# Altium schematic sheet Analyzer_MCUSchematic.SchDoc
size A3; SheetNumber: 2; SheetTotal: 3
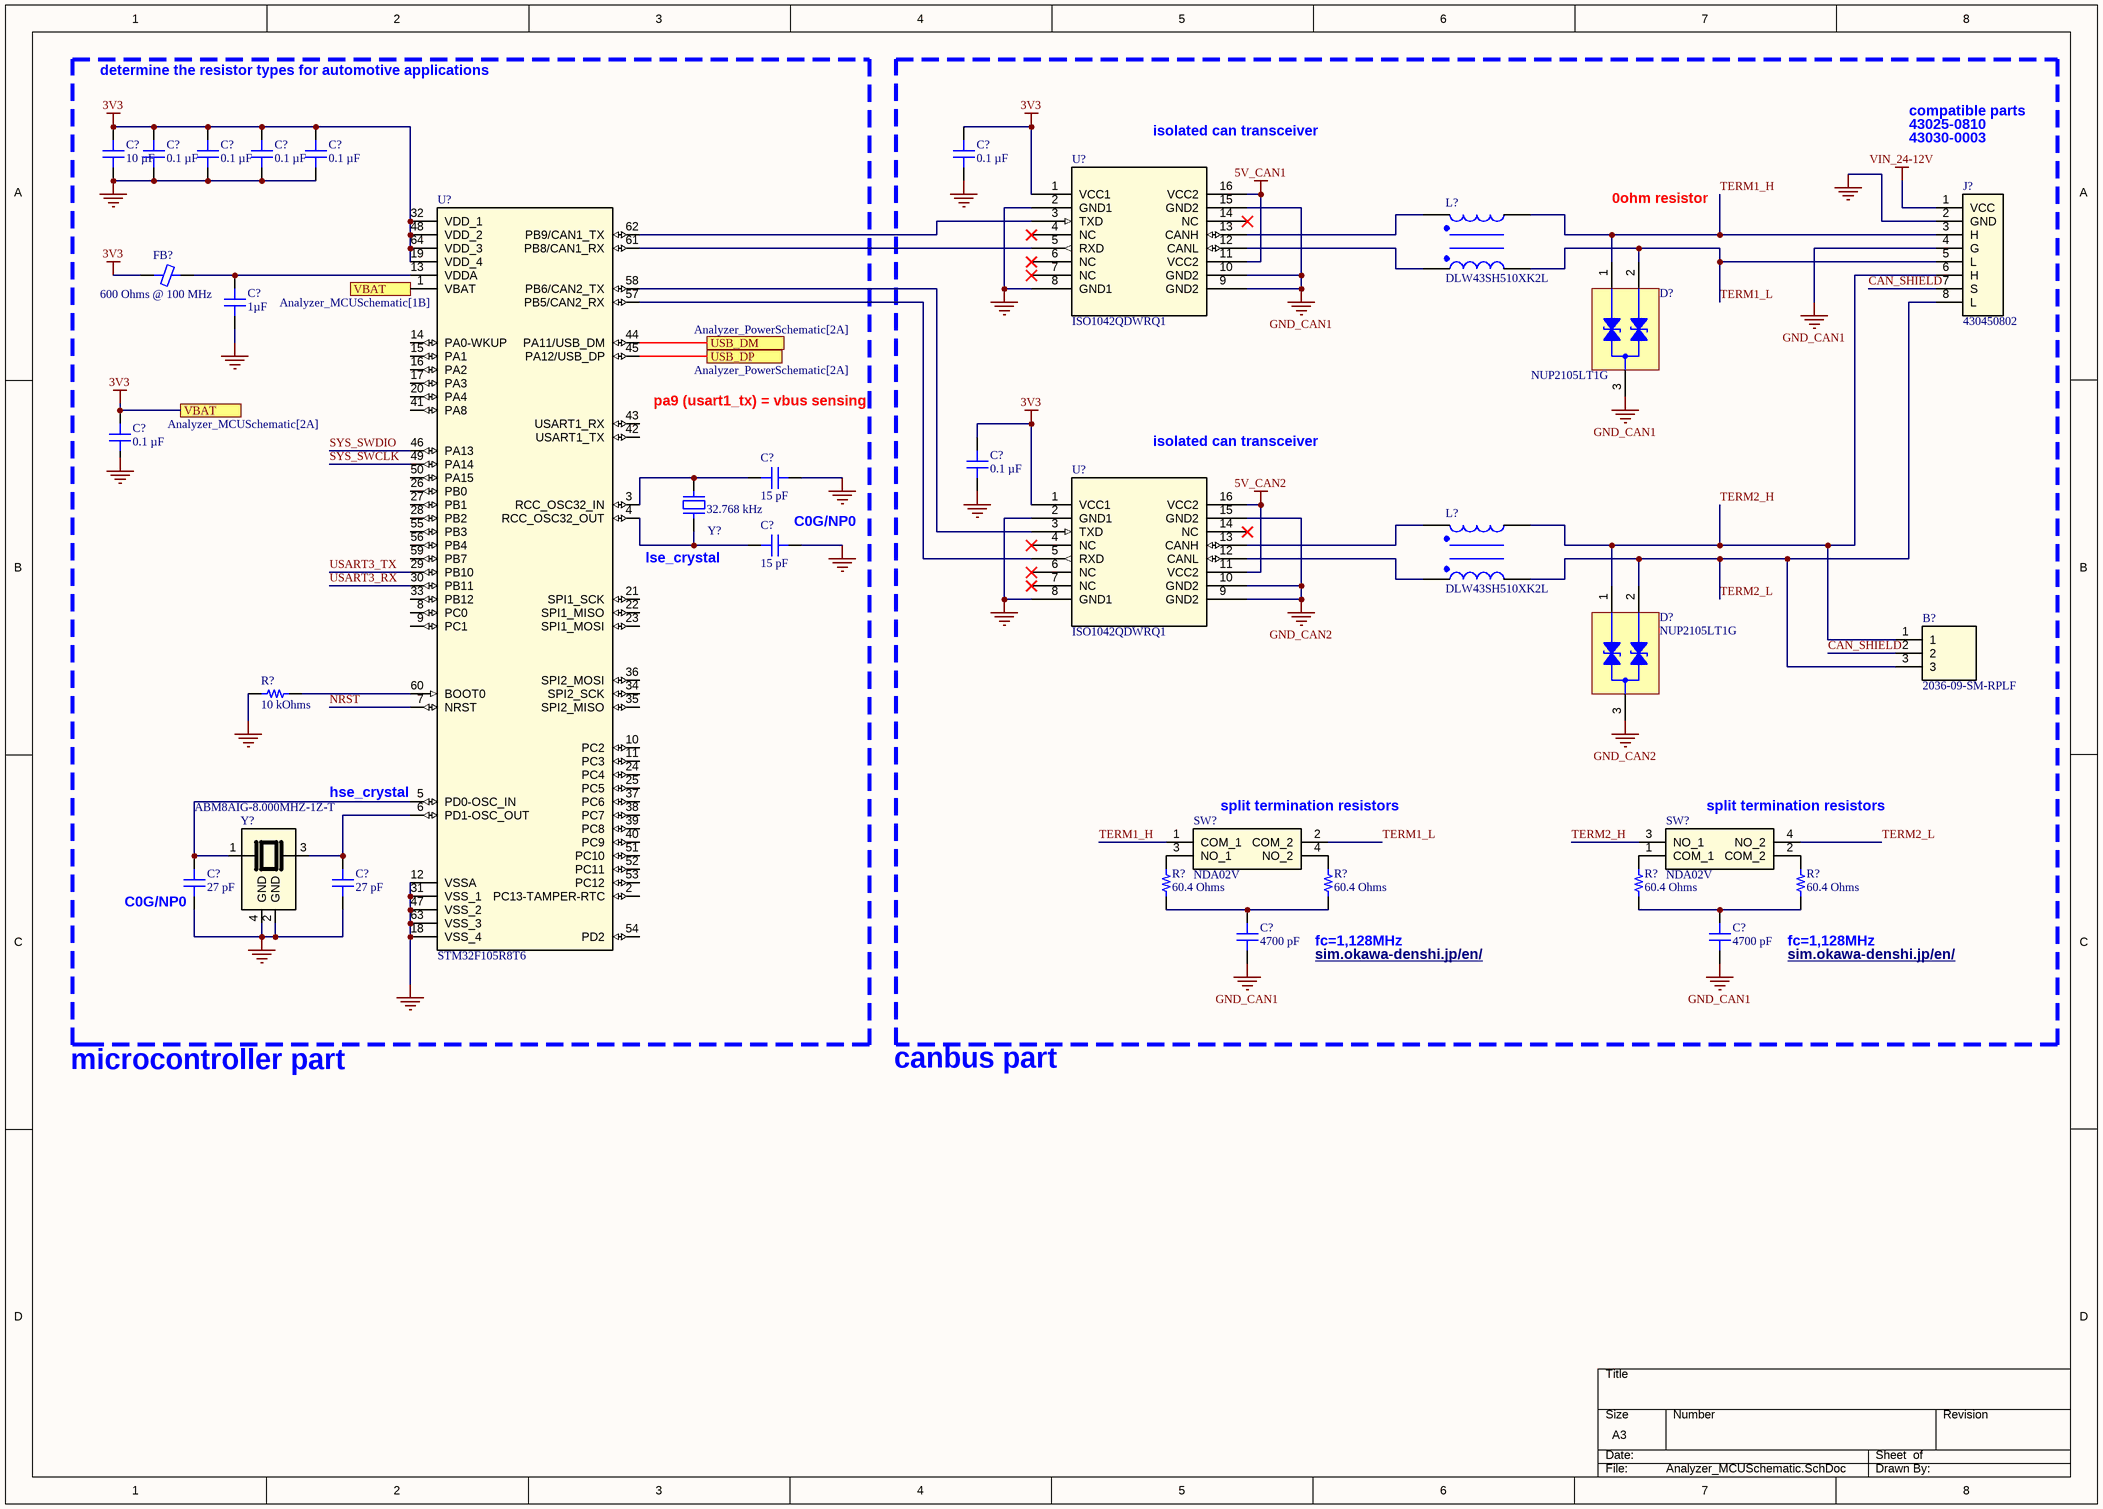
[diagram p0: Analyzer_MCUSchematic.SchDoc]

## Parts
(Parts that share a designator on the sheet are numbered #1, #2 ... from top to bottom, then left to right.)
B?  2036-09-SM-RPLF  [203609SMRPLF]
C?#1  10 µF  [CAP 0805_2012]
C?#2  0.1 µF  [CAP 0603_1608]
C?#3  0.1 µF  [CAP 0603_1608]
C?#4  0.1 µF  [CAP 0603_1608]
C?#5  0.1 µF  [CAP 0603_1608]
C?#6  0.1 µF  [CAP 0603_1608]
C?#7  1µF  [CAP 0603_1608]
C?#8  0.1 µF  [CAP 0603_1608]
C?#9  0.1 µF  [CAP 0603_1608]
C?#10  15 pF  [CAP 0603_1608]
C?#11  15 pF  [CAP 0603_1608]
C?#12  27 pF  [CAP 0603_1608]
C?#13  27 pF  [CAP 0603_1608]
C?#14  4700 pF  [CAP 0603_1608]
C?#15  4700 pF  [CAP 0603_1608]
D?#1  NUP2105LT1G  [ON SEMI SOT-23-3]
D?#2  NUP2105LT1G  [ON SEMI SOT-23-3]
FB?  600 Ohms @ 100 MHz  [FER 0603_1608]
J?  430450802  [CONN_SD-43045-001_08_MOL]
L?#1  DLW43SH510XK2L  [FIL_DLW43SH510XK2L]
L?#2  DLW43SH510XK2L  [FIL_DLW43SH510XK2L]
R?#1  10 kOhms  [RES 0603_1608]
R?#2  60.4 Ohms  [RES 0603_1608]
R?#3  60.4 Ohms  [RES 0603_1608]
R?#4  60.4 Ohms  [RES 0603_1608]
R?#5  60.4 Ohms  [RES 0603_1608]
SW?#1  NDA02V  [NDA02V]
SW?#2  NDA02V  [NDA02V]
U?#1  ISO1042QDWRQ1  [DW16_TEX]
U?#2  STM32F105R8T6  [QFP50P1200X1200X160-64N]
U?#3  ISO1042QDWRQ1  [DW16_TEX]
Y?#1  32.768 kHz  [ABRACON ABS06]
Y?#2  ABM8AIG-8.000MHZ-1Z-T  [XTAL_ABM8AIG-8.000MHZ-1Z-T]

## Ports
USB_DM (see Analyzer_PowerSchematic[2A]), USB_DP (see Analyzer_PowerSchematic[2A]), VBAT (see Analyzer_MCUSchematic[1B]), VBAT (see Analyzer_MCUSchematic[2A])

## Nets
3V3: C?#1.2 C?#2.2 C?#3.2 C?#4.2 C?#5.2 C?#6.2 C?#8.2 C?#9.2 FB?.1 U?#1.1(VCC1) U?#2.1(VBAT) U?#2.19(VDD_4) U?#2.32(VDD_1) U?#2.48(VDD_2) U?#2.64(VDD_3) U?#3.1(VCC1) ; port VBAT
5V_CAN1: U?#1.11(VCC2) U?#1.16(VCC2)
5V_CAN2: U?#3.11(VCC2) U?#3.16(VCC2)
GND: C?#1.1 C?#2.1 C?#3.1 C?#4.1 C?#5.1 C?#6.1 C?#7.1 C?#9.1 C?#10.2 C?#11.2 C?#12.1 C?#13.1 J?.2(GND) R?#1.1 U?#1.2(GND1) U?#1.8(GND1) U?#2.12(VSSA) U?#2.18(VSS_4) U?#2.31(VSS_1) U?#2.47(VSS_2) U?#2.63(VSS_3) U?#3.2(GND1) U?#3.8(GND1) Y?#2.2(GND) Y?#2.4(GND)
GND_CAN1: C?#14.1 C?#15.1 D?#1.3(I/O_2) J?.4(G) U?#1.9(GND2) U?#1.10(GND2) U?#1.15(GND2)
GND_CAN2: D?#2.3(I/O_2) U?#3.9(GND2) U?#3.10(GND2) U?#3.15(GND2)
VIN_24-12V: J?.1(VCC)
CAN_SHIELD: B?.2 J?.7(S)
NRST: U?#2.7(NRST)
SYS_SWCLK: U?#2.49(PA14)
SYS_SWDIO: U?#2.46(PA13)
TERM1_H: D?#1.1(I/O_1) J?.3(H) L?#1.2 SW?#2.1(COM_1)
TERM1_L: D?#1.2(GND) J?.5(L) L?#1.3 SW?#2.2(COM_2)
TERM2_H: B?.1 D?#2.1(I/O_1) J?.6(H) L?#2.2 SW?#1.3(NO_1)
TERM2_L: B?.3 D?#2.2(GND) J?.8(L) L?#2.3 SW?#1.4(NO_2)
USART3_RX: U?#2.30(PB11)
USART3_TX: U?#2.29(PB10)
USB_DM: U?#2.44(PA11/USB_DM) ; port USB_DM
USB_DP: U?#2.45(PA12/USB_DP) ; port USB_DP
NetC?#7_2: C?#7.2 FB?.2 U?#2.13(VDDA)
NetC?#10_1: C?#10.1 U?#2.3(RCC_OSC32_IN) Y?#1.1
NetC?#11_1: C?#11.1 U?#2.4(RCC_OSC32_OUT) Y?#1.2
NetC?#12_2: C?#12.2 Y?#2.1
NetC?#13_2: C?#13.2 Y?#2.3
NetC?#14_2: C?#14.2 R?#2.2 R?#3.2
NetC?#15_2: C?#15.2 R?#4.2 R?#5.2
NetL?#1_1: L?#1.1 U?#1.13(CANH)
NetL?#1_4: L?#1.4 U?#1.12(CANL)
NetL?#2_1: L?#2.1 U?#3.13(CANH)
NetL?#2_4: L?#2.4 U?#3.12(CANL)
NetR?#1_2: R?#1.2 U?#2.60(BOOT0)
NetR?#2_1: R?#2.1 SW?#2.3(NO_1)
NetR?#3_1: R?#3.1 SW?#2.4(NO_2)
NetR?#4_1: R?#4.1 SW?#1.1(COM_1)
NetR?#5_1: R?#5.1 SW?#1.2(COM_2)
NetU?#1_3: U?#1.3(TXD) U?#2.62(PB9/CAN1_TX)
NetU?#1_5: U?#1.5(RXD) U?#2.61(PB8/CAN1_RX)
NetU?#2_57: U?#2.57(PB5/CAN2_RX) U?#3.5(RXD)
NetU?#2_58: U?#2.58(PB6/CAN2_TX) U?#3.3(TXD)

Not connected (* = marked no-connect by the designer): C?#8 1; U?#1 4(NC)* 6(NC)* 7(NC)* 14(NC)*; U?#2 2(PC13-TAMPER-RTC) 5(PD0-OSC_IN) 6(PD1-OSC_OUT) 8(PC0) 9(PC1) 10(PC2) 11(PC3) 14(PA0-WKUP) 15(PA1) 16(PA2) 17(PA3) 20(PA4) 21(SPI1_SCK) 22(SPI1_MISO) 23(SPI1_MOSI) 24(PC4) 25(PC5) 26(PB0) 27(PB1) 28(PB2) 33(PB12) 34(SPI2_SCK) 35(SPI2_MISO) 36(SPI2_MOSI) 37(PC6) 38(PC7) 39(PC8) 40(PC9) 41(PA8) 42(USART1_TX) 43(USART1_RX) 50(PA15) 51(PC10) 52(PC11) 53(PC12) 54(PD2) 55(PB3) 56(PB4) 59(PB7); U?#3 4(NC)* 6(NC)* 7(NC)* 14(NC)*

## Notes on the sheet
- determine the resistor types for automotive applications
- isolated can transceiver
- compatible parts
- 43025-0810
- 43030-0003
- 0ohm resistor
- (near U?#2) pa9 (usart1_tx) = vbus sensing
- lse_crystal
- (near C?#11) C0G/NP0
- (near U?#2) hse_crystal
- (near SW?#2) split termination resistors
- (near SW?#1) split termination resistors
- (near C?#12) C0G/NP0
- (near R?#3) fc=1,128MHz
- sim.okawa-denshi.jp/en/ <http://sim.okawa-denshi.jp/en/>
- (near R?#5) fc=1,128MHz
- microcontroller part
- canbus part
- Labels drawn without touching a wire or pin: GND

## Library data of the parts
B? = 2036-09-SM-RPLF: SURGE ARRESTOR GDT 90V SMT Bourns 2036 Series 90V 10 kA@ 10 Operation, 20 kA@ 1 Operation SMD 3 Electrode Gas Discharge Tube; Geometry.Height: 5.2mm; Manufacturer_Name: Bourns; Manufacturer_Part_Number: 2036-09-SM-RPLF; Mouser Part Number: 652-2036-09-SM-RPLF; Mouser Price/Stock: https://www.mouser.co.uk/ProductDetail/Bourns/2036-09-SM-RPLF?qs=lCOfWMjvbt%252BBO3tBZtiSUQ%3D%3D; Arrow Part Number: 2036-09-SM-RPLF; Arrow Price/Stock: https://www.arrow.com/en/products/2036-09-sm-rplf/bourns?utm_currency=USD&region=nac; Datasheet Link: https://www.bourns.com/PDFs/2036-xx-SM.pdf
C?#1 = C2012X7R1A106K125AE: CAP CER 10UF 10V X7R 0805; manufacturer: TDK Corporation; Tolerance: ±10%; Part Number: C2012X7R1A106K125AE; Capacitance: 10 µF; Applications: Boardflex Sensitive; componentlink1description: Datasheet; componentlink1url: https://product.tdk.com/info/en/catalog/datasheets/mlcc_commercial_soft_en.pdf?ref_disty=digikey; componentlink2description: DigiKey Link; componentlink2url: https://www.digikey.com/en/products/detail/tdk-corporation/C2012X7R1A106K125AE/5809181; Device Package: 0805 (2012 Metric); Features: Soft Termination; lastupdated: 6.04.2026 19:33:17; Lifecycle Status: Active; Minimum Order: 1; Mounting Type: Surface Mount, MLCC; Operating Temperature: -55°C ~ 125°C; Package / Case: 0805 (2012 Metric); packaging: TapeAndReel; partid: 3036; Part Status: Active; price: 0.08; series: C; Size / Dimension: 0.079" L x 0.049" W (2.00mm x 1.25mm); Supplier 1: DigiKey; Supplier Part Number 1: 445-173616-1-ND; Temperature Coefficient: X7R; Thickness (Max): 0.059" (1.50mm); value: 10 µF; Voltage - Rated: 10V
C?#2-C?#6 C?#8 C?#9 = 0603B104J160CT: CAP CER 0.1UF 16V X7R 0603; manufacturer: Walsin Technology Corporation; Tolerance: ±5%; Part Number: 0603B104J160CT; Capacitance: 0.1 µF; Applications: General Purpose; componentlink1description: Datasheet; componentlink1url: http://www.passivecomponent.com/wp-content/uploads/2018/10/MLCC.pdf; componentlink2description: DigiKey Link; componentlink2url: https://www.digikey.com/en/products/detail/walsin-technology-corporation/0603B104J160CT/9354886; Device Package: 0603 (1608 Metric); lastupdated: 6.04.2026 19:23:13; Lifecycle Status: Active; Minimum Order: 1; Mounting Type: Surface Mount, MLCC; Operating Temperature: -55°C ~ 125°C; Package / Case: 0603 (1608 Metric); packaging: TapeAndReel; partid: 13150; Part Status: Active; price: 0.01; series: -; Size / Dimension: 0.063" L x 0.031" W (1.60mm x 0.80mm); Supplier 1: DigiKey; Supplier Part Number 1: 1292-1389-1-ND; Temperature Coefficient: X7R; Thickness (Max): 0.034" (0.87mm); value: 0.1 µF; Voltage - Rated: 16V
C?#7 = 0603YC105KAT2A: CAP CER 1UF 16V X7R 0603; manufacturer: AVX Corporation; Tolerance: ±10%; Part Number: 0603YC105KAT2A; Capacitance: 1µF; Applications: General Purpose; componentlink1description: Datasheet; componentlink1url: http://datasheets.avx.com/X7RDielectric.pdf; componentlink2description: DigiKey Link; componentlink2url: http://digikey.com/product-detail/en/avx-corporation/0603YC105KAT2A/478-5010-1-ND/1888221; Device Package: 0603 (1608 Metric); lastupdated: 2.09.2020 01:03:14; Lifecycle Status: Active; Minimum Order: 1; Mounting Type: Surface Mount, MLCC; Operating Temperature: -55°C ~ 125°C; Package / Case: 0603 (1608 Metric); packaging: TapeAndReel; partid: 14128; Part Status: Active; price: 0.04; series: -; Size / Dimension: 0.063" L x 0.032" W (1.60mm x 0.81mm); Supplier 1: DigiKey; Supplier Part Number 1: 478-5010-1-ND; Temperature Coefficient: X7R; Thickness (Max): 0.035" (0.90mm); value: 1µF; Voltage - Rated: 16V
C?#10 C?#11 = C0603C150J5GACAUTO: CAP CER 15PF 50V C0G/NP0 0603; manufacturer: KEMET; Temperature Coefficient: C0G, NP0; Tolerance: ±5%; Part Number: C0603C150J5GACAUTO; Capacitance: 15 pF; Applications: Automotive; componentlink1description: Datasheet; componentlink1url: https://api.kemet.com/component-edge/download/datasheet/C0603C150J5GACAUTO.pdf; componentlink2description: DigiKey Link; componentlink2url: https://www.digikey.com/en/products/detail/kemet/C0603C150J5GACAUTO/3314856; Device Package: 0603 (1608 Metric); Features: Low ESL; lastupdated: 6.04.2026 19:23:31; Lifecycle Status: Active; Minimum Order: 1; Mounting Type: Surface Mount, MLCC; Operating Temperature: -55°C ~ 125°C; Package / Case: 0603 (1608 Metric); packaging: TapeAndReel; partid: 7972; Part Status: Active; price: 0.01; Ratings: AEC-Q200; series: SMD Auto C0G; Size / Dimension: 0.063" L x 0.031" W (1.60mm x 0.80mm); Supplier 1: DigiKey; Supplier Part Number 1: 399-6859-1-ND; Thickness (Max): 0.034" (0.87mm); value: 15 pF; Voltage - Rated: 50V
C?#12 C?#13 = C0603C270J5GACAUTO: CAP CER 27PF 50V C0G/NP0 0603; manufacturer: KEMET; Temperature Coefficient: C0G, NP0; Tolerance: ±5%; Part Number: C0603C270J5GACAUTO; Capacitance: 27 pF; Applications: Automotive; componentlink1description: Datasheet; componentlink1url: https://api.kemet.com/component-edge/download/datasheet/C0603C270J5GACAUTO.pdf; componentlink2description: DigiKey Link; componentlink2url: https://www.digikey.com/en/products/detail/kemet/C0603C270J5GACAUTO/7516234; Device Package: 0603 (1608 Metric); Features: Low ESL; lastupdated: 6.04.2026 19:23:16; Lifecycle Status: Active; Minimum Order: 1; Mounting Type: Surface Mount, MLCC; Operating Temperature: -55°C ~ 125°C; Package / Case: 0603 (1608 Metric); packaging: TapeAndReel; partid: 12459; Part Status: Active; price: 0.01; Ratings: AEC-Q200; series: SMD Auto C0G; Size / Dimension: 0.063" L x 0.031" W (1.60mm x 0.80mm); Supplier 1: DigiKey; Supplier Part Number 1: 399-16001-1-ND; Thickness (Max): 0.034" (0.87mm); value: 27 pF; Voltage - Rated: 50V
C?#14 C?#15 = C1608NP01H472J080AA: CAP CER 4700PF 50V NP0 0603; manufacturer: TDK Corporation; Temperature Coefficient: C0G, NP0; Tolerance: ±5%; Part Number: C1608NP01H472J080AA; Capacitance: 4700 pF; Applications: General Purpose; componentlink1description: Datasheet; componentlink1url: https://product.tdk.com/info/en/catalog/datasheets/mlcc_commercial_hightemp_en.pdf?ref_disty=digikey; componentlink2description: DigiKey Link; componentlink2url: https://www.digikey.com/en/products/detail/tdk-corporation/C1608NP01H472J080AA/3951319; Device Package: 0603 (1608 Metric); Features: High Temperature; lastupdated: 6.04.2026 19:23:27; Lifecycle Status: Active; Minimum Order: 1; Mounting Type: Surface Mount, MLCC; Operating Temperature: -55°C ~ 150°C; Package / Case: 0603 (1608 Metric); packaging: TapeAndReel; partid: 9062; Part Status: Active; price: 0.04; series: C; Size / Dimension: 0.063" L x 0.031" W (1.60mm x 0.80mm); Supplier 1: DigiKey; Supplier Part Number 1: 445-14083-1-ND; Thickness (Max): 0.035" (0.90mm); value: 4700 pF; Voltage - Rated: 50V
D?#1 D?#2 = NUP2105LT1G: TVS DIODE 24V 44V SOT23-3; Manufacturer: ON Semiconductor; Bidirectional Channels: 2; Capacitance @ Frequency: 30pF @ 1MHz; Current - Peak Pulse (10/1000µs): 8A (8/20µs); Power Line Protection: No; Power - Peak Pulse: 350W; Type: Zener; Voltage - Breakdown (Min): 26.2V; Voltage - Reverse Standoff (Typ): 24V (Min); Part Number: NUP2105LT1G; Applications: General Purpose; ComponentLink1Description: Datasheet; ComponentLink1URL: http://www.onsemi.com/pub/Collateral/NUP2105L-D.PDF; ComponentLink2Description: DigiKey Link; ComponentLink2URL: http://digikey.com/product-detail/en/on-semiconductor/NUP2105LT1G/NUP2105LT1GOSCT-ND/1485001; Device Package: TO-236-3, SC-59, SOT-23-3; LastUpdated: 30.03.2020 16:33:57; Lifecycle Status: Active; Minimum Order: 1; Mounting Type: Surface Mount; Operating Temperature: -55°C ~ 150°C (TJ); Package / Case: TO-236-3, SC-59, SOT-23-3; Packaging: TapeAndReel; PartId: 10506; Part Status: Active; Price: 0.09; Series: -; Supplier 1: DigiKey; Supplier Part Number 1: NUP2105LT1GOSCT-ND; Supplier Device Package: SOT-23-3 (TO-236); Voltage - Clamping (Max) @ Ipp: 44V
FB? = GZ1608D601TF: FERRITE BEAD 600 OHM 0603 1LN; Manufacturer: Shenzhen Sunlord Electronics Co., Ltd.; Current Rating (Max): 200mA; DC Resistance (DCR) (Max): 450mOhm; Filter Type: Signal Line; Number of Lines: 1; Part Number: GZ1608D601TF; ComponentLink1Description: Datasheet; ComponentLink1URL: https://www.sunlordinc.com/Download.aspx?file=L1VwbG9hZEZpbGVzL1BERl9DYXQvMjAxOTA0MDgxMzU0MTk3NjMucGRm&lan=en; ComponentLink2Description: DigiKey Link; ComponentLink2URL: https://www.digikey.com/en/products/detail/shenzhen-sunlord-electronics-co-ltd/GZ1608D601TF/14120345; Device Package: 0603 (1608 Metric); Height (Max): 0.037" (0.95mm); Impedance @ Frequency: 600 Ohms @ 100 MHz; LastUpdated: 5.04.2026 20:28:01; Lifecycle Status: Active; Minimum Order: 1; Mounting Type: Surface Mount; Operating Temperature: -55°C ~ 125°C; Package / Case: 0603 (1608 Metric); Packaging: TapeAndReel; PartId: 2637; Part Status: Active; Price: 0.01; Series: GZ; Size / Dimension: 0.063" L x 0.031" W (1.60mm x 0.80mm); Supplier 1: DigiKey; Supplier Part Number 1: 3442-GZ1608D601TFCT-ND; Value: 600 Ohms @ 100 MHz
J? = 430450802: Micro-Fit 3.0 Right-Angle Header, 3.00mm Pitch, Dual Row, 8 Circuits, with Snap-in Plastic Peg PCB Lock, 0.76Âµm Gold Plating, Glow-Wire Capable, Black; Manufacturer_Name: Molex; Copyright: Copyright (C) 2026 Ultra Librarian. All rights reserved.; Manufacturer_Part_Number: 430450802; Datasheet: https://www.molex.com/en-us/products/part-detail-pdf/430450802?display=pdf; Digi-Key_Part_Number_1: WM1822-ND; RefDes: RefDes; Type: Type
L?#1 L?#2 = DLW43SH510XK2L: 51µH @ 1MHz 2 Line Common Mode Choke Surface Mount 230mA DCR 1Ohm; MF: Murata; Value: *; MP: DLW43SH510XK2L; SnapEDA_Link: https://www.snapeda.com/parts/DLW43SH510XK2L/Murata/view-part/4300308/?ref=snap; Availability: Unavailable; Price: None; Package: 1812 Murata
R?#1 = RT0603FRE0710KL: RES SMD 10K OHM 1% 1/10W 0603; Manufacturer: Yageo; Power (Watts): 0.1W, 1/10W; Temperature Coefficient: ±50ppm/°C; Part Number: RT0603FRE0710KL; Value: 10 kOhms; ComponentLink1Description: Datasheet; ComponentLink1URL: https://www.yageo.com/upload/media/product/productsearch/datasheet/rchip/PYu-RT_1-to-0.01_RoHS_L_11.pdf; ComponentLink2Description: DigiKey Link; ComponentLink2URL: https://www.digikey.com/en/products/detail/yageo/RT0603FRE0710KL/1075040; Composition: Thin Film; Device Package: 0603 (1608 Metric); Height - Seated (Max): 0.022" (0.55mm); LastUpdated: 6.04.2026 19:44:01; Lifecycle Status: Active; Minimum Order: 1; Number of Terminations: 2; Operating Temperature: -55°C ~ 155°C; Package / Case: 0603 (1608 Metric); Packaging: TapeAndReel; PartId: 5671; Part Status: Active; Price: 0.01; Resistance: 10 kOhms; Series: RT; Size / Dimension: 0.063" L x 0.031" W (1.60mm x 0.80mm); Supplier 1: DigiKey; Supplier Part Number 1: YAG2321CT-ND; Supplier Device Package: 0603; Tolerance: ±1%
R?#2-R?#5 = RC0603FR-0760R4L: RES 60.4 OHM 1% 1/10W 0603; Manufacturer: Yageo; Power (Watts): 0.1W, 1/10W; Temperature Coefficient: ±100ppm/°C; Part Number: RC0603FR-0760R4L; Value: 60.4 Ohms; ComponentLink1Description: Datasheet; ComponentLink1URL: https://www.yageo.com/upload/media/product/productsearch/datasheet/rchip/PYu-RC_Group_51_RoHS_L_10.pdf; ComponentLink2Description: DigiKey Link; ComponentLink2URL: https://www.digikey.com/en/products/detail/yageo/RC0603FR-0760R4L/727327; Composition: Thick Film; Device Package: 0603 (1608 Metric); Features: Moisture Resistant; Height - Seated (Max): 0.022" (0.55mm); LastUpdated: 6.04.2026 19:43:46; Lifecycle Status: Active; Minimum Order: 1; Number of Terminations: 2; Operating Temperature: -55°C ~ 155°C; Package / Case: 0603 (1608 Metric); Packaging: CutTape; PartId: 19096; Part Status: Active; Price: 0.01; Resistance: 60.4 Ohms; Series: RC_L; Size / Dimension: 0.063" L x 0.031" W (1.60mm x 0.80mm); Supplier 1: DigiKey; Supplier Part Number 1: 311-60.4HRCT-ND; Supplier Device Package: 0603; Tolerance: ±1%
SW?#1 SW?#2 = NDA02V: SWITCH DIL RA SPST 50MA 24V TH; Manufacturer_Name: Apem; Geometry.Height: 9.9mm; Manufacturer_Part_Number: NDA02V; Mouser Part Number: 642-NDA02V; Mouser Price/Stock: https://www.mouser.co.uk/ProductDetail/Apem/NDA02V?qs=W0yvOO0ixfEICVFeWba0EQ%3D%3D; Arrow Part Number: *; Arrow Price/Stock: *; Datasheet Link: https://www.apem.com/us/nda-series-174.html
U?#1 U?#3 = ISO1042QDWRQ1: Automotive, isolated CAN transceiver with 70-V bus fault protection & flexible data rate 16-SOIC -40 to 125; Manufacturer_Name: Texas Instruments; Copyright: Copyright (C) 2026 Ultra Librarian. All rights reserved.; Manufacturer_Part_Number: ISO1042QDWRQ1; Datasheet: https://www.ti.com/lit/gpn/iso1042-q1; Digi-Key_Part_Number_1: 296-52278-1-ND; Digi-Key_Part_Number_2: 296-52278-2-ND; Digi-Key_Part_Number_3: 296-52278-6-ND; RefDes: RefDes; Type: Type
U?#2 = STM32F105R8T6: Mainstream Connectivity line, ARM Cortex-M3 with 64 Kbytes Flash, 72 MHz CPU, CAN, USB 2.0 OTG; MF: {'manufacturer': u'STMicroelectronics'}; Package: None; Price: None; Value: *; MP: STM32F105R8T6; Availability: Unavailable
Y?#1 = ABS06-32.768KHZ-1-T: CRYSTAL 32.7680KHZ 12.5PF SMD; Manufacturer: Abracon LLC; ESR (Equivalent Series Resistance): 90 kOhms; Frequency Tolerance: ±10ppm; Operating Mode: Fundamental; Part Number: ABS06-32.768KHZ-1-T; ComponentLink1Description: Datasheet; ComponentLink1URL: https://abracon.com/Resonators/ABS06.pdf; ComponentLink2Description: DigiKey Link; ComponentLink2URL: https://www.digikey.com/en/products/detail/abracon-llc/ABS06-32-768KHZ-1-T/2217994; Frequency: 32.768 kHz; Height - Seated (Max): 0.024" (0.60mm); LastUpdated: 5.04.2026 20:41:05; Lifecycle Status: Active; Load Capacitance: 12.5pF; Minimum Order: 1; Mounting Type: Surface Mount; Operating Temperature: -40°C ~ 85°C; Package / Case: 2-SMD, No Lead; Packaging: TapeAndReel; PartId: 370; Part Status: Active; Price: 0.36; Series: ABS06; Size / Dimension: 0.079" L x 0.047" W (2.00mm x 1.20mm); Supplier 1: DigiKey; Supplier Part Number 1: 535-10248-1-ND; Type: kHz Crystal (Tuning Fork); Value: 32.768 kHz
Y?#2 = ABM8AIG-8.000MHZ-1Z-T: 8 MHz Â±10ppm Crystal 18pF 500 Ohms 4-SMD, No Lead; MF: Abracon LLC; SnapEDA_Link: https://www.snapeda.com/parts/ABM8AIG-8.000MHZ-1Z-T/Abracon/view-part/?ref=snap; Package: NON STANDARD Abracon; Value: *; MP: ABM8AIG-8.000MHZ-1Z-T; Check_prices: https://www.snapeda.com/parts/ABM8AIG-8.000MHZ-1Z-T/Abracon/view-part/?ref=eda